# EAGLE design Contatore a relay 4bit - Product (EAGLE 9.6.2)
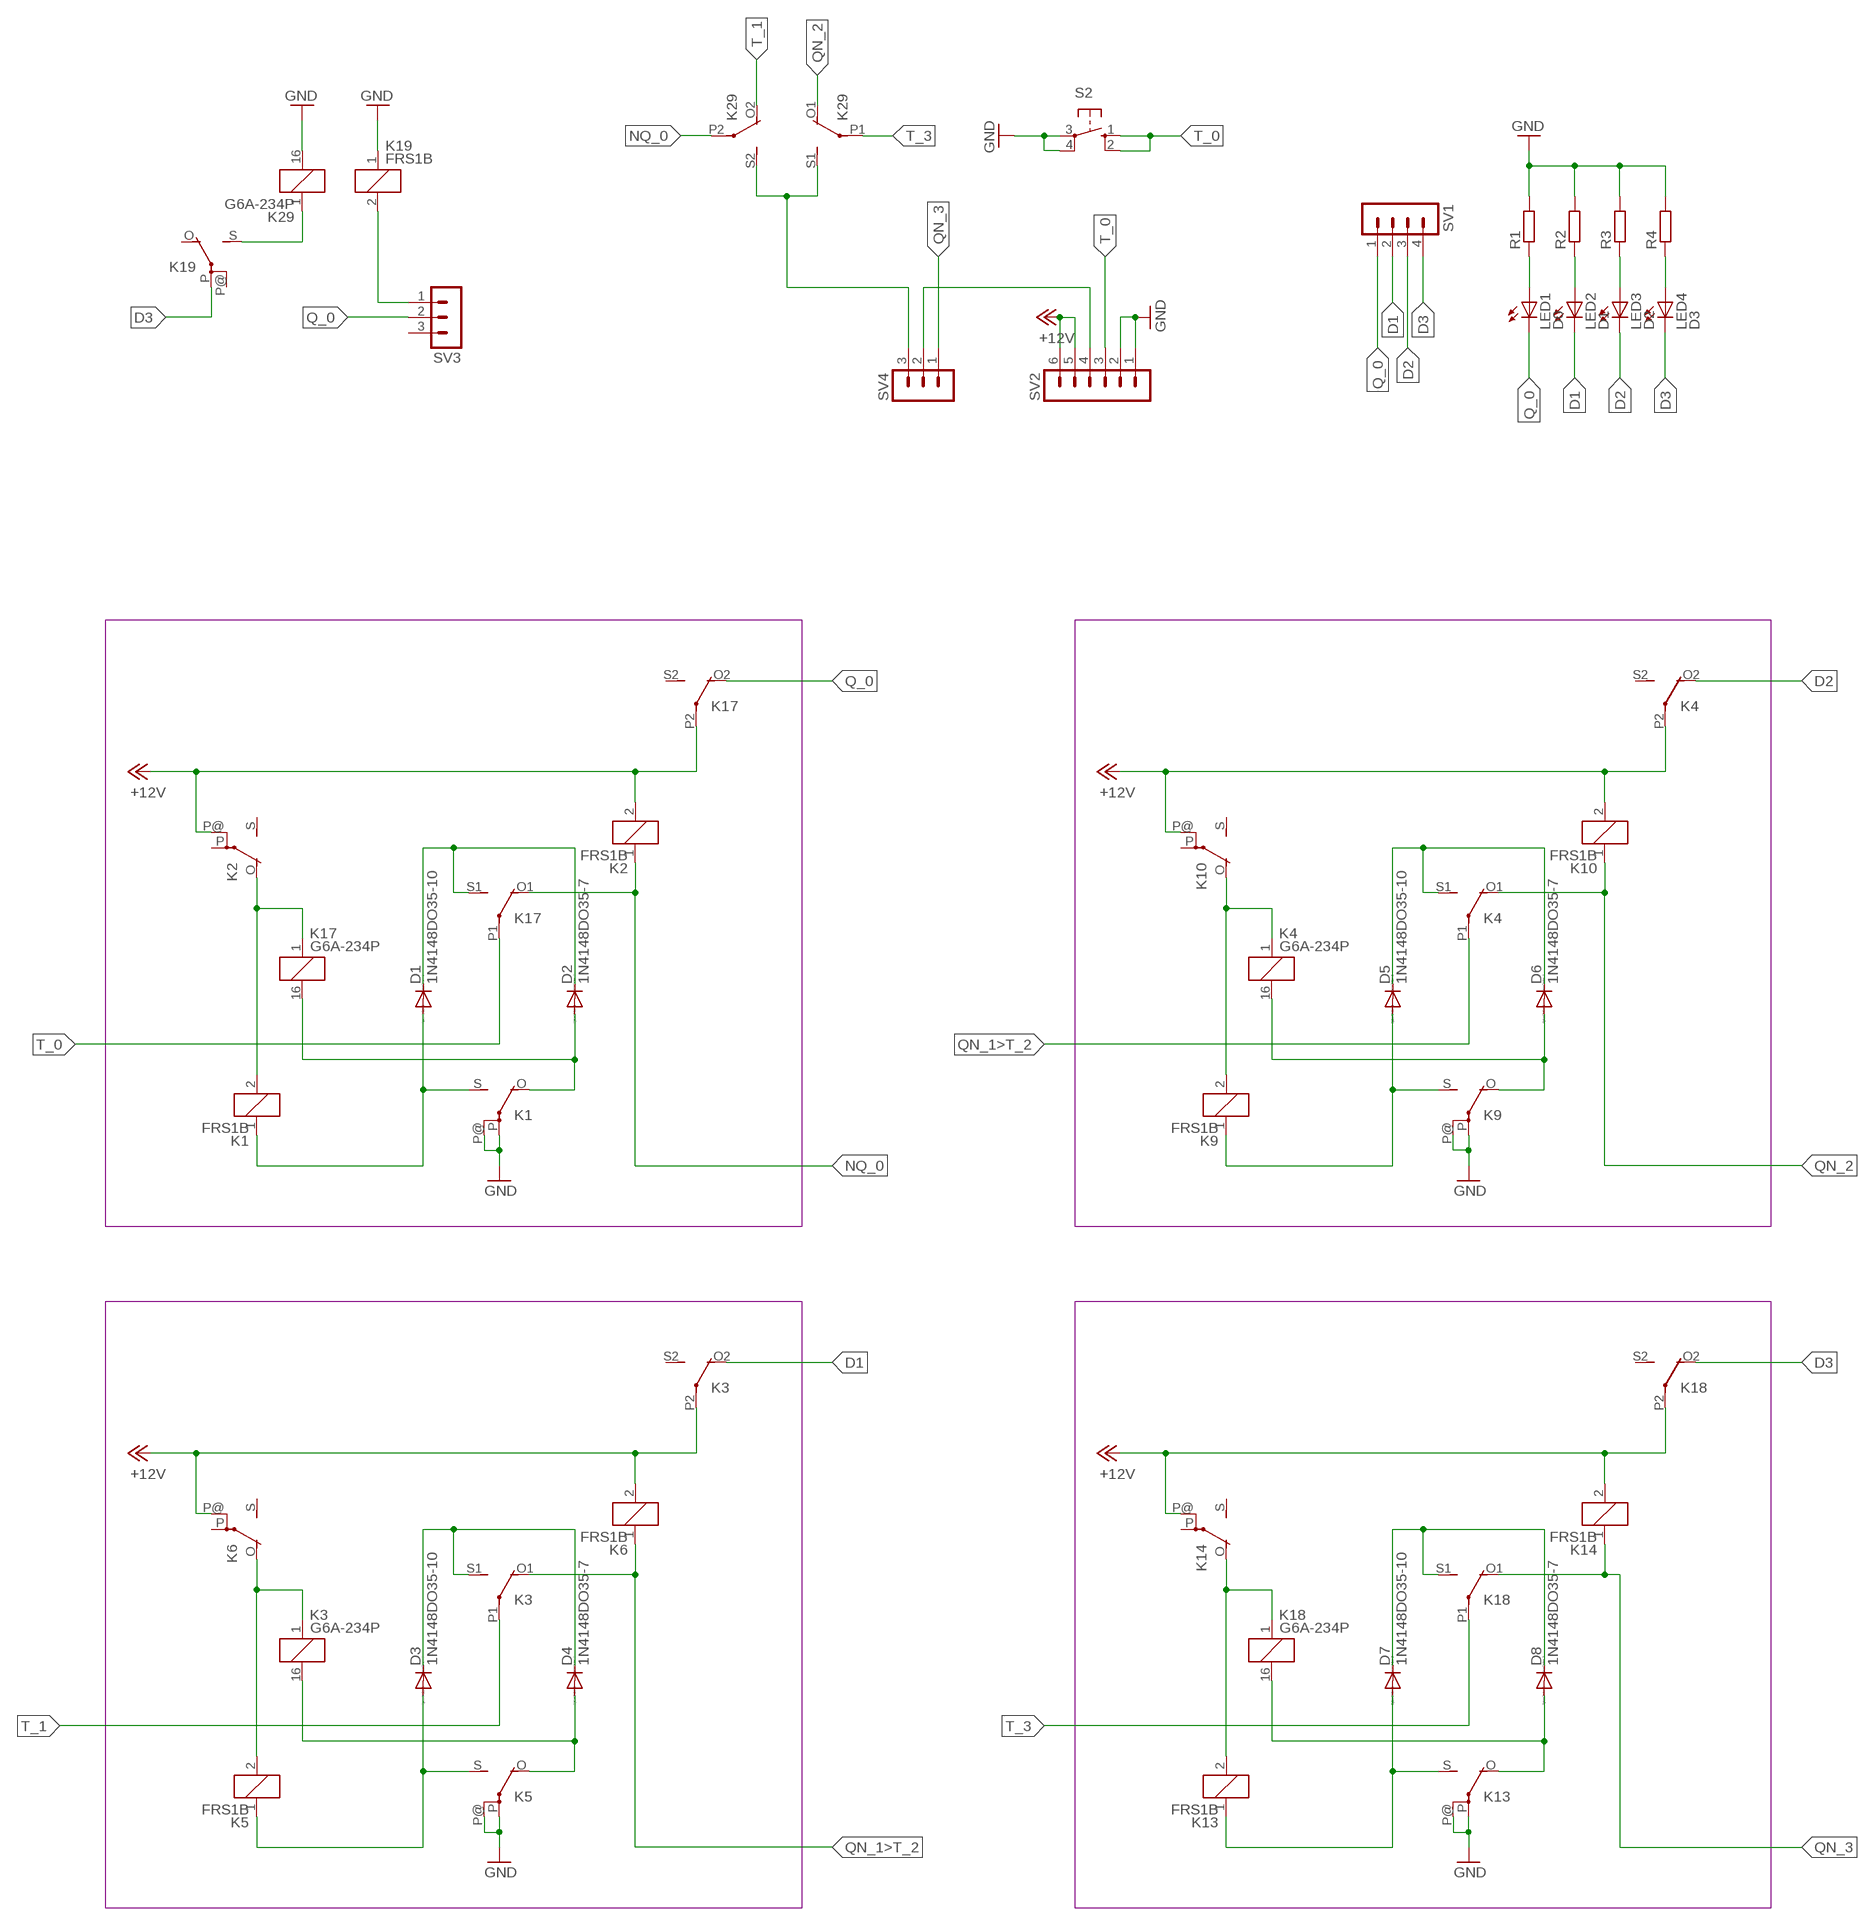
[diagram p0: schematic, sheet 1]

## Parts
D1  1N4148DO35-10  [DO35-10]
D2  1N4148DO35-7  [DO35-7]
D3  1N4148DO35-10  [DO35-10]
D4  1N4148DO35-7  [DO35-7]
D5  1N4148DO35-10  [DO35-10]
D6  1N4148DO35-7  [DO35-7]
D7  1N4148DO35-10  [DO35-10]
D8  1N4148DO35-7  [DO35-7]
K1  FRS1B  [FRS1B]
K2  FRS1B  [FRS1B]
K3  G6A-234P  [G6A-234P]
K4  G6A-234P  [G6A-234P]
K5  FRS1B  [FRS1B]
K6  FRS1B  [FRS1B]
K9  FRS1B  [FRS1B]
K10  FRS1B  [FRS1B]
K13  FRS1B  [FRS1B]
K14  FRS1B  [FRS1B]
K17  G6A-234P  [G6A-234P]
K18  G6A-234P  [G6A-234P]
K19  FRS1B  [FRS1B]
K29  G6A-234P  [G6A-234P]
LED1  D0  LED3MM  [LED3MM]
LED2  D1  LED3MM  [LED3MM]
LED3  D2  LED3MM  [LED3MM]
LED4  D3  LED3MM  [LED3MM]
R1  R-EU_M0805  [M0805]
R2  R-EU_M0805  [M0805]
R3  R-EU_M0805  [M0805]
R4  R-EU_M0805  [M0805]
S2  10-XX  [B3F-10XX]
SV1  MA04-1  [MA04-1]
SV2  MA06-1  [MA06-1]
SV3  MA03-1  [MA03-1]
SV4  MA03-1  [MA03-1]

## Nets
+12V: K2.2 K2.P@(2:P) K3.P2(3:P) K4.P2(3:P) K6.2 K6.P@(2:P) K10.2 K10.P@(2:P) K14.2 K14.P@(2:P) K17.P2(3:P) K18.P2(3:P) SV2.5 SV2.6
D1: K3.O2(3:O) LED2.K(C) SV1.2
D2: K4.O2(3:O) LED3.K(C) SV1.3
D3: K18.O2(3:O) K19.P(2:P) LED4.K(C) SV1.4
GND: K1.P(2:P) K1.P@(2:P) K5.P(2:P) K5.P@(2:P) K9.P(2:P) K9.P@(2:P) K13.P(2:P) K13.P@(2:P) K19.1 K29.16 R1.2 R2.2 R3.2 R4.2 S2.3(P) S2.4(P1) SV2.1 SV2.2
N$1: D2.A K1.O(2:O) K17.16
N$2: D4.A K3.16 K5.O(2:O)
N$3: D1.A K1.1 K1.S(2:S)
N$4: D3.A K5.1 K5.S(2:S)
N$5: K3.1 K5.2 K6.O(2:O)
N$6: K1.2 K2.O(2:O) K17.1
N$10: D3.C D4.C K3.S1(2:S)
N$13: D6.A K4.16 K9.O(2:O)
N$14: D5.A K9.1 K9.S(2:S)
N$15: K4.1 K9.2 K10.O(2:O)
N$17: D1.C D2.C K17.S1(2:S)
N$19: D5.C D6.C K4.S1(2:S)
N$21: K29.S1(2:S) K29.S2(3:S) SV4.3
N$22: D8.A K13.O(2:O) K18.16
N$23: D7.A K13.1 K13.S(2:S)
N$24: K13.2 K14.O(2:O) K18.1
N$26: LED1.A R1.1
N$27: D7.C D8.C K18.S1(2:S)
N$29: K19.S(2:S) K29.1
N$31: LED2.A R2.1
N$32: LED3.A R3.1
N$33: LED4.A R4.1
N$35: K19.2 SV3.1
N$36: SV2.4 SV4.2
NQ_0: K2.1 K17.O1(2:O) K29.P2(3:P)
Q_0: K17.O2(3:O) LED1.K(C) SV1.1 SV3.2
QN_1>T_2: K3.O1(2:O) K4.P1(2:P) K6.1
QN_2: K4.O1(2:O) K10.1 K29.O1(2:O)
QN_3: K14.1 K18.O1(2:O) SV4.1
T_0: K17.P1(2:P) S2.1(S) S2.2(S1) SV2.3
T_1: K3.P1(2:P) K29.O2(3:O)
T_3: K18.P1(2:P) K29.P1(2:P)
Unconnected: K2.P(2:P) K2.S(2:S) K3.S2(3:S) K4.S2(3:S) K6.P(2:P) K6.S(2:S) K10.P(2:P) K10.S(2:S) K14.P(2:P) K14.S(2:S) K17.S2(3:S) K18.S2(3:S) K19.O(2:O) K19.P@(2:P) SV3.3

## Library data of the parts
D1-D8 = diode:1N4148: DIODE high speed (Philips)
K1 K2 K5 K6 K9 K10 K13 K14 K19 = relay:FRS1B: RELAY 1 x switch, same as V23101-D6-A201, Siemens; OC_FARNELL: unknown; OC_NEWARK: unknown
K3 K4 K17 K18 K29 = relay:G6A-234P: RELAY 2 x switch, 0.3 A/125 V AC, 1 A/30 V DC, Omron; OC_FARNELL: unknown; OC_NEWARK: unknown
LED1-LED4 = led:LED: LED OSRAM: - CHIPLED LG R971, LG N971, LY N971, LG Q971, LY Q971, LO R971, LY R971 LH N974, LH R974 LS Q976, LO Q976, LY Q976 LO Q996 - Hyper CHIPLED LW Q18S LB Q993, LB Q99A, LB R99A - SideLED LS A670, LO A670, LY A670, LG A670, LP A670 LB A673, LV A673, LT A673, LW A673 LH A674 LY A675 LS A676, LA A676, LO A676, LY A676, LW A676 LS A679, LY A679, LG A679 - Hyper Micro SIDELED® LS Y876, LA Y876, LO Y876, LY Y876 LT Y87S - SmartLED LW L88C, LW L88S LB L89C, LB L89S, LG L890 LS L89K, LO L89K, LY L89K LS L896, LA L896, LO L896, LY L896 - TOPLED LS T670, LO T670, LY T670, LG T670, LP T670 LSG T670, LSP T670, LSY T670, LOP T670, LYG T670 LG T671, LOG T671, LSG T671 LB T673, LV T673, LT T673, LW T673 LH T674 LS T676, LA T676, LO T676, LY T676, LB T676, LH T676, LSB T676, LW T676 LB T67C, LV T67C, LT T67C, LS T67K, LO T67K, LY T67K, LW E67C LS E67B, LA E67B, LO E67B, LY E67B, LB E67C, LV E67C, LT E67C LW T67C LS T679, LY T679, LG T679 LS T770, LO T770, LY T770, LG T770, LP T770 LB T773, LV T773, LT T773, LW T773 LH T774 LS E675, LA E675, LY E675, LS T675 LS T776, LA T776, LO T776, LY T776, LB T776 LHGB T686 LT T68C, LB T68C - Hyper Mini TOPLED® LB M676 - Mini TOPLED Santana® LG M470 LS M47K, LO M47K, LY M47K Source: http://www.osram.convergy.de LUXEON: - LUMILED® LXK2-PW12-R00, LXK2-PW12-S00, LXK2-PW14-U00, LXK2-PW14-V00 LXK2-PM12-R00, LXK2-PM12-S00, LXK2-PM14-U00 LXK2-PE12-Q00, LXK2-PE12-R00, LXK2-PE12-S00, LXK2-PE14-T00, LXK2-PE14-U00 LXK2-PB12-K00, LXK2-PB12-L00, LXK2-PB12-M00, LXK2-PB14-N00, LXK2-PB14-P00, LXK2-PB14-Q00 LXK2-PR12-L00, LXK2-PR12-M00, LXK2-PR14-Q00, LXK2-PR14-R00 LXK2-PD12-Q00, LXK2-PD12-R00, LXK2-PD12-S00 LXK2-PH12-R00, LXK2-PH12-S00 LXK2-PL12-P00, LXK2-PL12-Q00, LXK2-PL12-R00 Source: www.luxeon.com KINGBRIGHT: KA-3528ASYC Source: www.kingbright.com
R1-R4 = rcl:R-EU_: RESISTOR, European symbol
S2 = switch-omron:10-XX: OMRON SWITCH; MPN: B3F-1000; OC_FARNELL: 176432; OC_NEWARK: 36M3542
SV1 = con-lstb:MA04-1: PIN HEADER; OC_FARNELL: unknown; OC_NEWARK: unknown
SV2 = con-lstb:MA06-1: PIN HEADER; OC_FARNELL: unknown; OC_NEWARK: unknown
SV3 SV4 = con-lstb:MA03-1: PIN HEADER; OC_FARNELL: unknown; OC_NEWARK: unknown

## Board
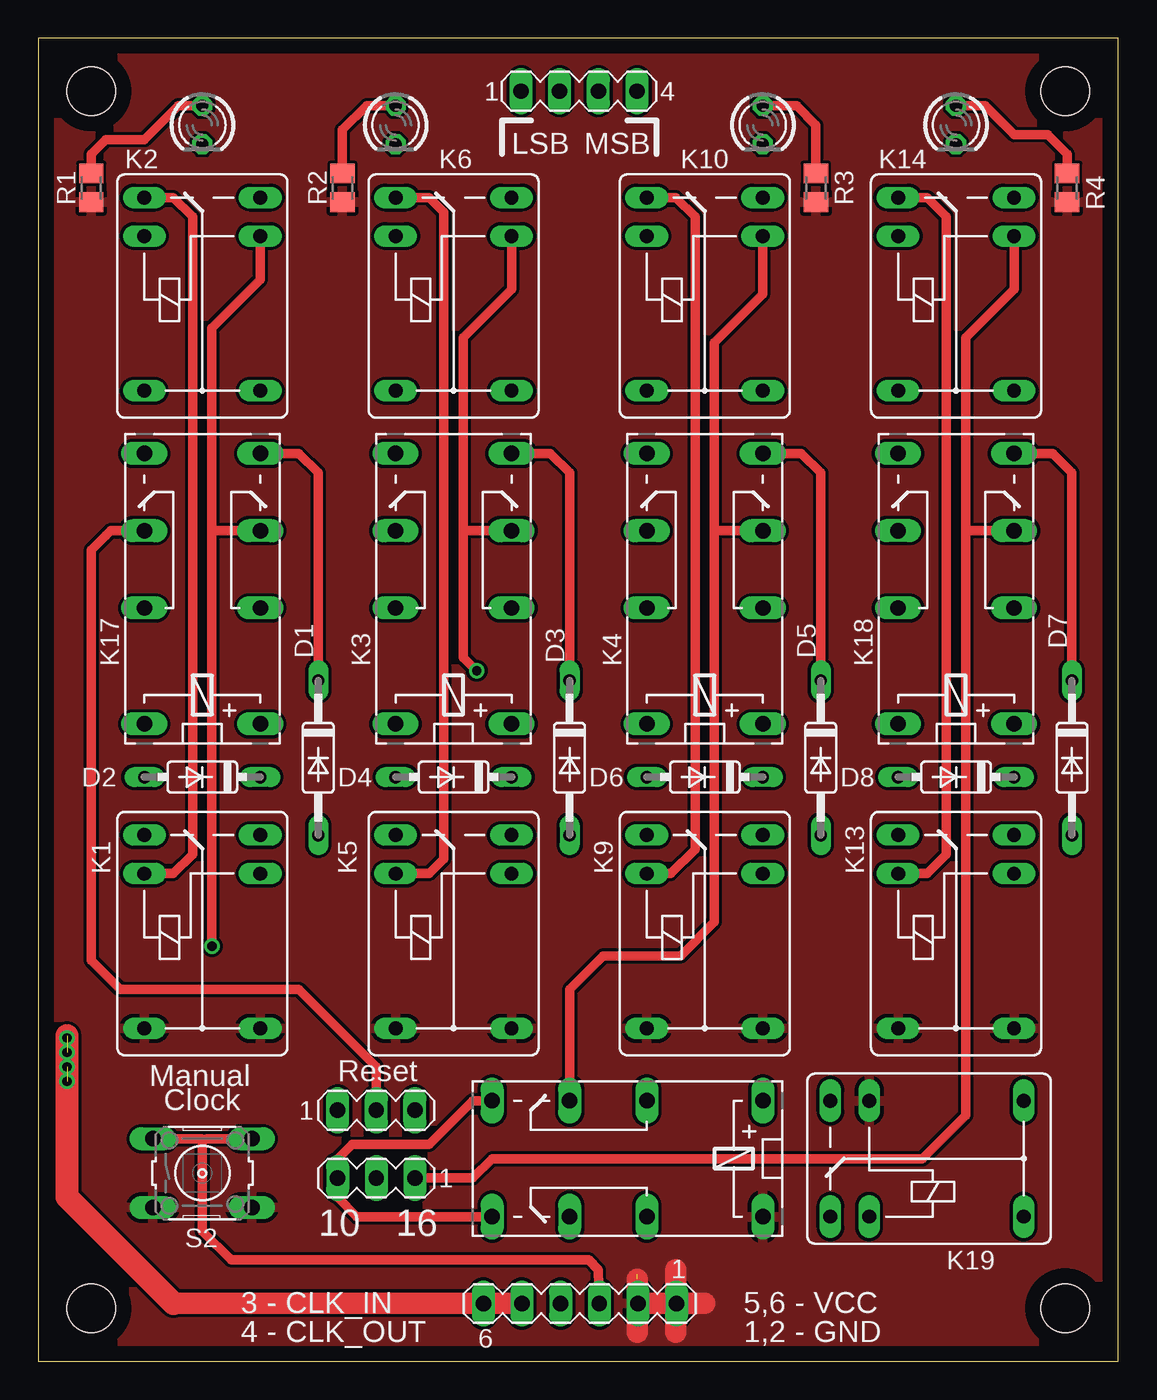
[diagram p1: board, top side]
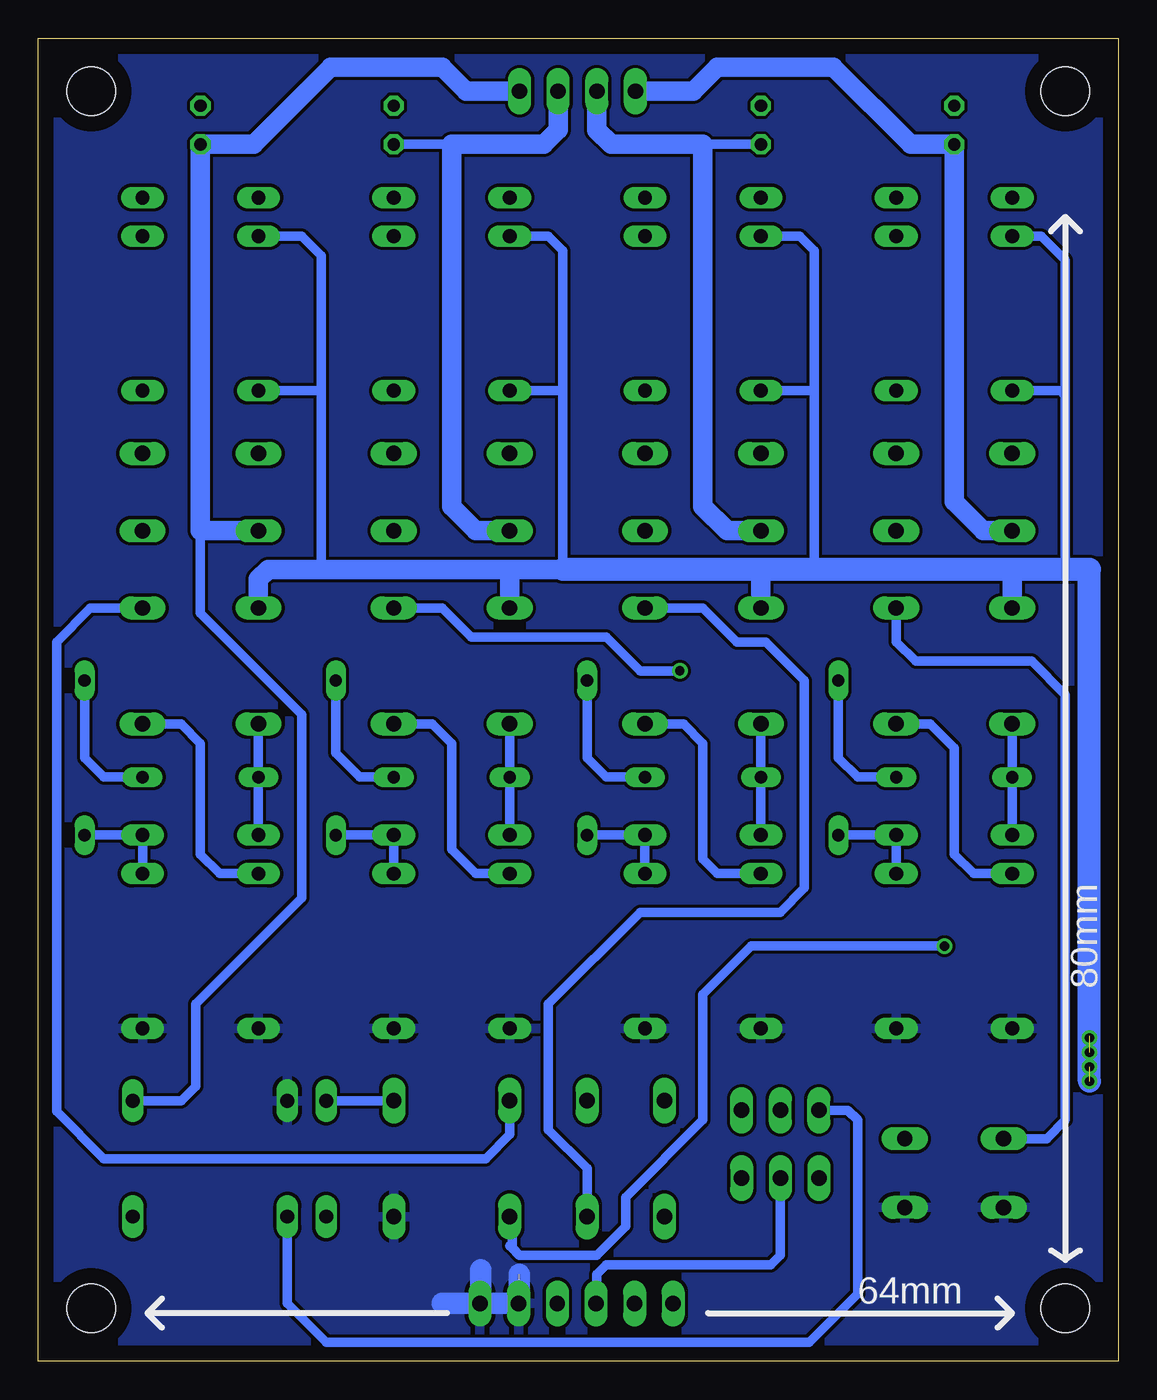
[diagram p2: board, bottom side, seen from below]

Size 71 x 87 mm. Coordinates in mm from the lower left corner, seen from the top.
Outline: 0,0 71,0 71,87 0,87 0,0
Copper layers (1*16): Top 0.035mm / dielectric 1.5mm / Bottom 0.035mm
Design rules "default *": minimum track width 10mil, minimum drill 24mil, track to track 8mil, track to pad 8mil, pad to pad 8mil, via to via 8mil, smd to smd 8mil, copper to edge 40mil, drill to drill 8mil, minimum pad ring 10mil, minimum via ring 8mil, stop-mask expansion 4mil, vias tented up to drill 0mil, thermal gap 10mil
Holes 3.2 mm at 3.5,83.5 67.5,83.5 67.5,3.5 3.5,3.5

### Footprints (pad centres in the part's own frame; a part is rotated, then mirrored left to right if it is on the bottom)
DO35-10 = drill 0.813 long: A 5.08,0; C -5.08,0
DO35-7 = drill 0.813 long: A 3.81,0; C -3.81,0
FRS1B = drill 0.914 long: 1 0,3.81; 2 0,-3.81; O -2.54,-3.81; P 10.16,3.81; P@ 10.16,-3.81; S -2.54,3.81
G6A-234P = drill 1.016 long: 1 -3.81,-3.81; 16 -3.81,3.81; O1 8.89,-3.81; O2 8.89,3.81; P1 3.81,-3.81; P2 3.81,3.81; S1 13.97,-3.81; S2 13.97,3.81
LED3MM = drill 0.813 octagon: A -1.27,0; K 1.27,0
M0805 = smd 1.3 x 1.6: 1 -0.95,0; 2 0.95,0
B3F-10XX = drill 1.016 long: 1 -3.251,2.261; 2 3.251,2.261; 3 -3.251,-2.261; 4 3.251,-2.261
MA04-1 = drill 1.016 long: 1 -3.81,0; 2 -1.27,0; 3 1.27,0; 4 3.81,0
MA06-1 = drill 1.016 long: 1 -6.35,0; 2 -3.81,0; 3 -1.27,0; 4 1.27,0; 5 3.81,0; 6 6.35,0
MA03-1 = drill 1.016 long: 1 -2.54,0; 2 0,0; 3 2.54,0

### Placement (x,y rotation side)
D1  18.41,39.69 270 top
D2  10.79,38.42 180 top
D3  34.92,39.69 270 top
D4  27.3,38.42 180 top
D5  51.44,39.69 270 top
D6  43.81,38.42 180 top
D7  67.94,39.69 270 top
D8  60.33,38.42 180 top
K1  10.79,32.07 270 top
K2  10.79,73.98 270 top
K3  27.3,45.72 90 top
K4  43.81,45.72 90 top
K5  27.3,32.07 270 top
K6  27.3,73.98 270 top
K9  43.81,32.07 270 top
K10  43.81,73.98 270 top
K13  60.33,32.07 270 top
K14  60.33,73.98 270 top
K17  10.79,45.72 90 top
K18  60.33,45.72 90 top
K19  54.61,13.34 0 top
K29  43.81,13.34 180 top
LED1  10.79,81.28 270 top
LED2  23.5,81.28 270 top
LED3  47.62,81.28 270 top
LED4  60.33,81.28 270 top
R1  3.49,77.15 270 top
R2  20,77.15 270 top
R3  51.12,77.15 270 top
R4  67.63,77.15 270 top
S2  10.79,12.38 0 top
SV1  35.55,83.5 0 top
SV2  35.61,3.81 180 top
SV3  22.23,16.51 0 top
SV4  22.23,12.06 180 top

### Tracks (layer width: path | path; a pad name or v marks a point on that pad's centre or on a via)
+12V  (via drill 0.61)  (3 unrouted)
  Top 1.422: SV2.6 SV2.5 8.89,3.81
  Top 1.5: 8.89,3.81 1.91,10.79 v1.91,18.41 1.91,21.41
  Bottom 0.61: K2.2 5.08,73.98 3.49,72.39 3.49,63.5 | K2.P@ 3.81,63.82 3.49,63.5 | 3.49,52.07 3.49,63.5 | K6.2 20.95,73.98 20,73.03 20,63.82 | 20,63.82 20,52.07 | K6.P@ 20,63.82 | K10.2 37.47,73.98 36.51,73.03 36.51,63.82 | 36.51,63.82 36.51,52.07 | K10.P@ 36.51,63.82 | K14.2 53.66,73.98 52.39,72.71 52.39,63.82 | 52.39,63.82 52.39,52.07 | K14.P@ 52.39,63.82
  Bottom 1.27: K18.P2 56.52,51.44 55.88,52.07 52.39,52.07 40.01,52.07 | 36.51,52.07 40.01,52.07 | K4.P2 40.01,52.07 | K17.P2 6.99,52.07 | K3.P2 23.5,52.07
  Bottom 1.5: v1.91,18.41 1.91,52.07 3.49,52.07 6.99,52.07 20,52.07 23.5,52.07 36.51,52.07
  other vias: 1.91,19.37 1.91,20.32 1.91,21.27
D1
  Bottom 0.61: 27.3,80.01 LED2.K | K3.O2 23.81,54.61
  Bottom 1.27: SV1.2 34.28,80.95 33.34,80.01 27.3,80.01 27.3,56.2 25.72,54.61 23.81,54.61 22.86,54.61
D2
  Bottom 0.61: 43.81,80.01 LED3.K
  Bottom 1.27: SV1.3 36.82,80.97 37.78,80.01 43.81,80.01 43.81,56.2 42.23,54.61 K4.O2
D3
  Bottom 0.61: 60.33,54.61 60.33,49.21 53.66,42.55 53.66,30.48 60.64,23.5 60.64,18.1 61.59,17.14 K19.P
  Bottom 1.27: SV1.4 42.86,83.5 44.45,85.09 51.75,85.09 56.83,80.01 LED4.K 60.33,54.61 K18.O2
GND  (1 unrouted)
  Top 1.422: 39.37,5.4 39.37,3.81 | 39.37,3.81 39.37,1.91 | 41.91,6.03 41.91,1.91 | 43.81,3.81 39.37,3.81
  Bottom 1.422: 44.45,3.81 41.91,3.81 | 41.91,3.81 39.37,3.81 | 41.91,6.03 41.91,3.81 | 39.37,5.71 39.37,3.49
  pour Bottom: -1,-1 72,-1 72,89 -1,89
  pour Top: -2,-2 73,-2 73,90 -2,90
N$1
  Bottom 0.61: K1.O D2.A K17.16
N$2
  Bottom 0.61: K5.O D4.A K3.16
N$3
  Bottom 0.61: D1.A K1.S K1.1
N$4
  Bottom 0.61: D3.A K5.S K5.1
N$5
  Top 0.61: K6.O 25.72,76.52 26.67,75.56 26.67,33.02 25.72,32.07 K5.2
  Bottom 0.61: K5.2 26.35,32.07 27.3,33.02 27.3,40.64 28.57,41.91 K3.1
N$6
  Top 0.61: K2.O 8.89,76.52 10.16,75.25 10.16,33.34 8.89,32.07 K1.2
  Bottom 0.61: K1.2 9.53,32.07 10.79,33.34 10.79,40.32 12.38,41.91 K17.1
N$10
  Top 0.61: D3.C 34.92,58.42 33.66,59.69 K3.S1
  Bottom 0.61: D4.C 33.66,38.42 34.92,39.69 D3.C
N$13
  Bottom 0.61: K9.O D6.A K4.16
N$14
  Bottom 0.61: K9.1 K9.S D5.A
N$15
  Top 0.61: K10.O 41.91,76.52 43.18,75.25 43.18,33.66 41.59,32.07 K9.2
  Bottom 0.61: K9.2 42.23,32.07 43.81,33.66 43.81,40.64 45.09,41.91 K4.1
N$17
  Top 0.61: D1.C 18.41,58.42 17.14,59.69 K17.S1
  Bottom 0.61: D2.C 17.14,38.42 18.41,39.69 D1.C
N$19
  Top 0.61: D5.C 51.44,58.42 50.16,59.69 K4.S1
  Bottom 0.61: D6.C 49.85,38.42 51.44,40.01 D5.C
N$21
  Top 0.61: K29.S2 20.95,9.53 19.68,10.79 SV4.3 19.68,13.34 20.64,14.29 25.72,14.29 28.57,17.14 K29.S1
N$22
  Bottom 0.61: K13.O D8.A K18.16
N$23
  Bottom 0.61: D7.A K13.S K13.1
N$24
  Top 0.61: K14.O 58.42,76.52 59.69,75.25 59.69,33.34 58.42,32.07 K13.2
  Bottom 0.61: K13.2 59.05,32.07 60.33,33.34 60.33,40.64 61.59,41.91 K18.1
N$26
  Top 0.61: LED1.A 9.21,82.55 6.99,80.33 4.45,80.33 3.49,79.38 R1.1
N$27
  Top 0.61: D7.C 67.94,58.42 66.67,59.69 K18.S1
  Bottom 0.61: D8.C 66.67,38.42 67.94,39.69 D7.C
N$29
  Bottom 0.61: K29.1 K19.S
N$31
  Top 0.61: LED2.A 21.59,82.55 20,80.96 R2.1
N$32
  Top 0.61: LED3.A 49.85,82.55 51.12,81.28 R3.1
N$33
  Top 0.61: LED4.A 62.23,82.55 64.14,80.64 66.36,80.64 67.63,79.38 R4.1
N$35
  Bottom 0.61: SV3.1 17.78,16.51 17.14,15.88 17.14,4.45 20.32,1.27 52.07,1.27 54.61,3.81 K19.2
N$36
  Bottom 0.61: SV2.4 34.28,5.72 33.66,6.35 22.86,6.35 22.23,6.99 SV4.2
NQ_0  (via drill 0.61)
  Top 0.61: 11.43,54.61 11.43,67.94 14.61,71.12 K2.1 | K17.O1 11.43,54.61 | v11.43,27.3 11.43,54.61
  Bottom 0.61: 39.85,7.46 39.37,6.99 34.29,6.99 32.38,8.89 32.38,10.79 27.3,15.88 27.3,24.13 24.13,27.3 v11.43,27.3 | 39.85,7.46 40.01,7.62 | 39.85,7.46 39.85,9.37 K29.P2
Q_0
  Top 0.61: SV3.2 22.23,19.37 17.14,24.45 5.4,24.45 3.49,26.35 3.49,53.34 4.45,54.29 4.76,54.61 K17.O2
  Bottom 1.27: SV1.1 27.94,83.5 26.35,85.09 18.73,85.09 13.65,80.01 LED1.K 10.79,56.52 8.89,54.61 K17.O2
QN_1>T_2  (via drill 0.61)
  Top 0.61: 27.94,54.61 K3.O1 | 27.94,54.61 27.94,46.29 v28.83,45.4 | 27.94,54.61 27.94,67.31 31.11,70.48 K6.1
  Bottom 0.61: v28.83,45.4 31.43,45.4 33.66,47.62 42.55,47.62 44.45,49.53 K4.P1
QN_2
  Top 0.61: K4.O1 44.45,54.61 | 44.45,54.61 44.45,66.99 47.62,70.17 K10.1 | 44.45,54.61 44.45,28.89 42.23,26.67 37.15,26.67 34.92,24.45 K29.O1
QN_3
  Top 0.61: SV4.1 28.57,12.06 29.84,13.34 58.1,13.34 60.96,16.19 60.96,54.61 | 60.96,54.61 60.96,67.31 64.14,70.48 K14.1 | K18.O1 60.96,54.61
T_0
  Top 0.61: SV2.3 36.82,6.04 36.2,6.67 12.7,6.67 10.79,8.57 10.79,14.61 | 10.79,14.61 11.07,14.64 S2.2 | S2.1 10.76,14.64 10.79,14.61
  Bottom 0.61: K17.P1 14.61,47.31 13.34,46.04 5.71,46.04 3.49,43.81 3.49,15.88 4.72,14.64 S2.1
T_1
  Bottom 0.61: K3.P1 27.3,49.53 25.08,47.31 23.18,47.31 20.64,44.77 20.64,31.11 22.23,29.53 31.43,29.53 37.47,23.5 37.47,15.24 34.92,12.7 K29.O2
T_3
  Bottom 0.61: K18.P1 67.56,49.53 69.78,47.31 69.78,16.44 66.67,13.34 41.59,13.34 40.01,14.92 K29.P1

### Text on the board
tNames: LSB | MSB | Manual | Reset | Clock | 10 | 16 | 3 - CLK_IN | 5,6 - VCC | 4 - CLK_OUT | 1,2 - GND
bNames: 80mm | 64mm